# Altium schematic sheet dc-dc_eth.SchDoc
size 420 x 297 mm; Address1: Address1; Address2: Address2; Address3: Address3; Address4: Address4; SheetNumber: 4; SheetTotal: 5
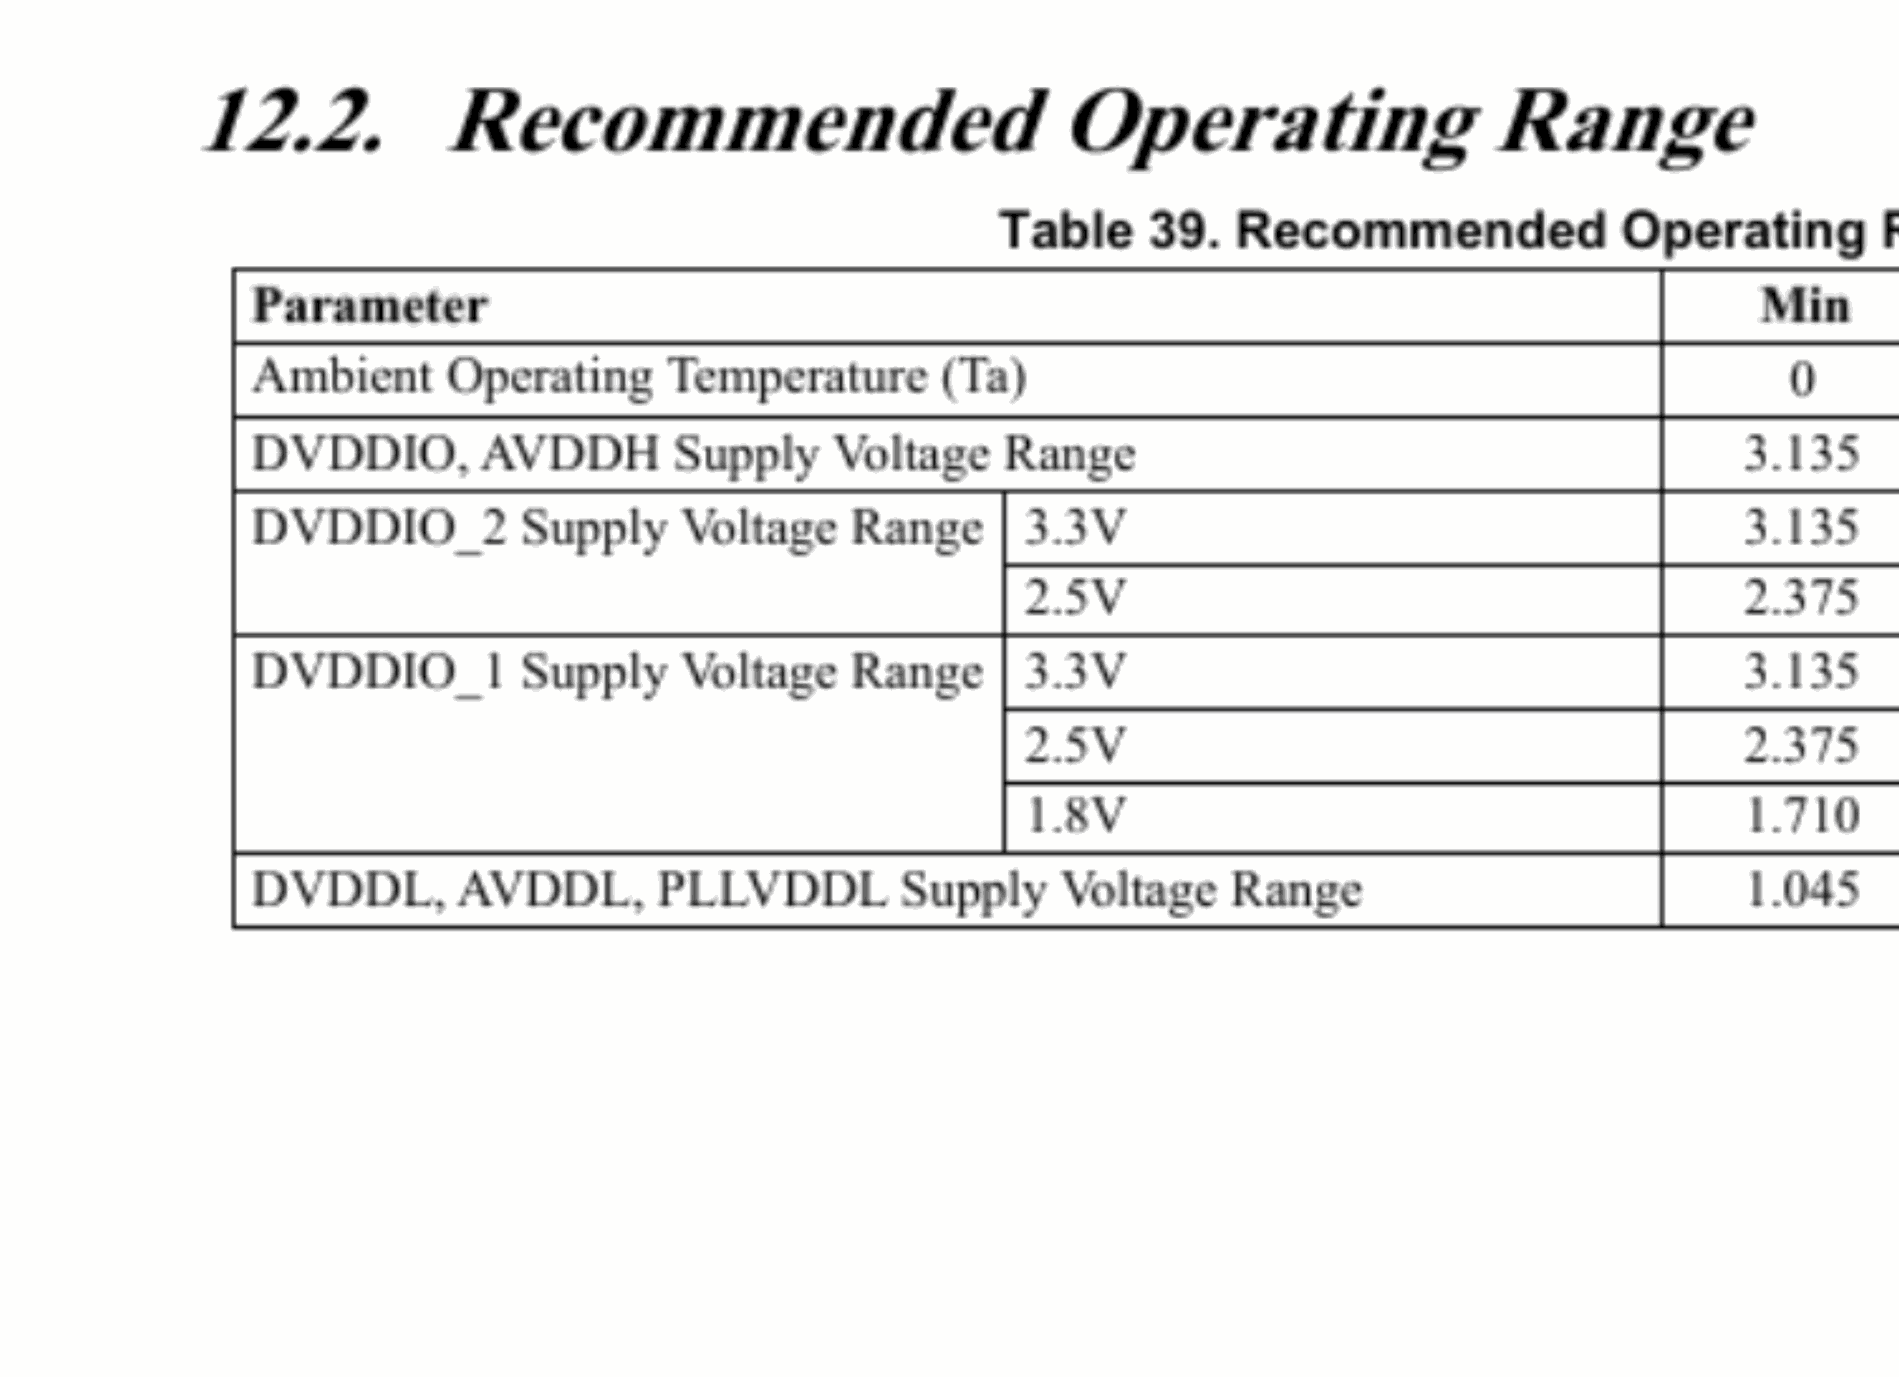
[diagram p0: dc-dc_eth.SchDoc, top left]
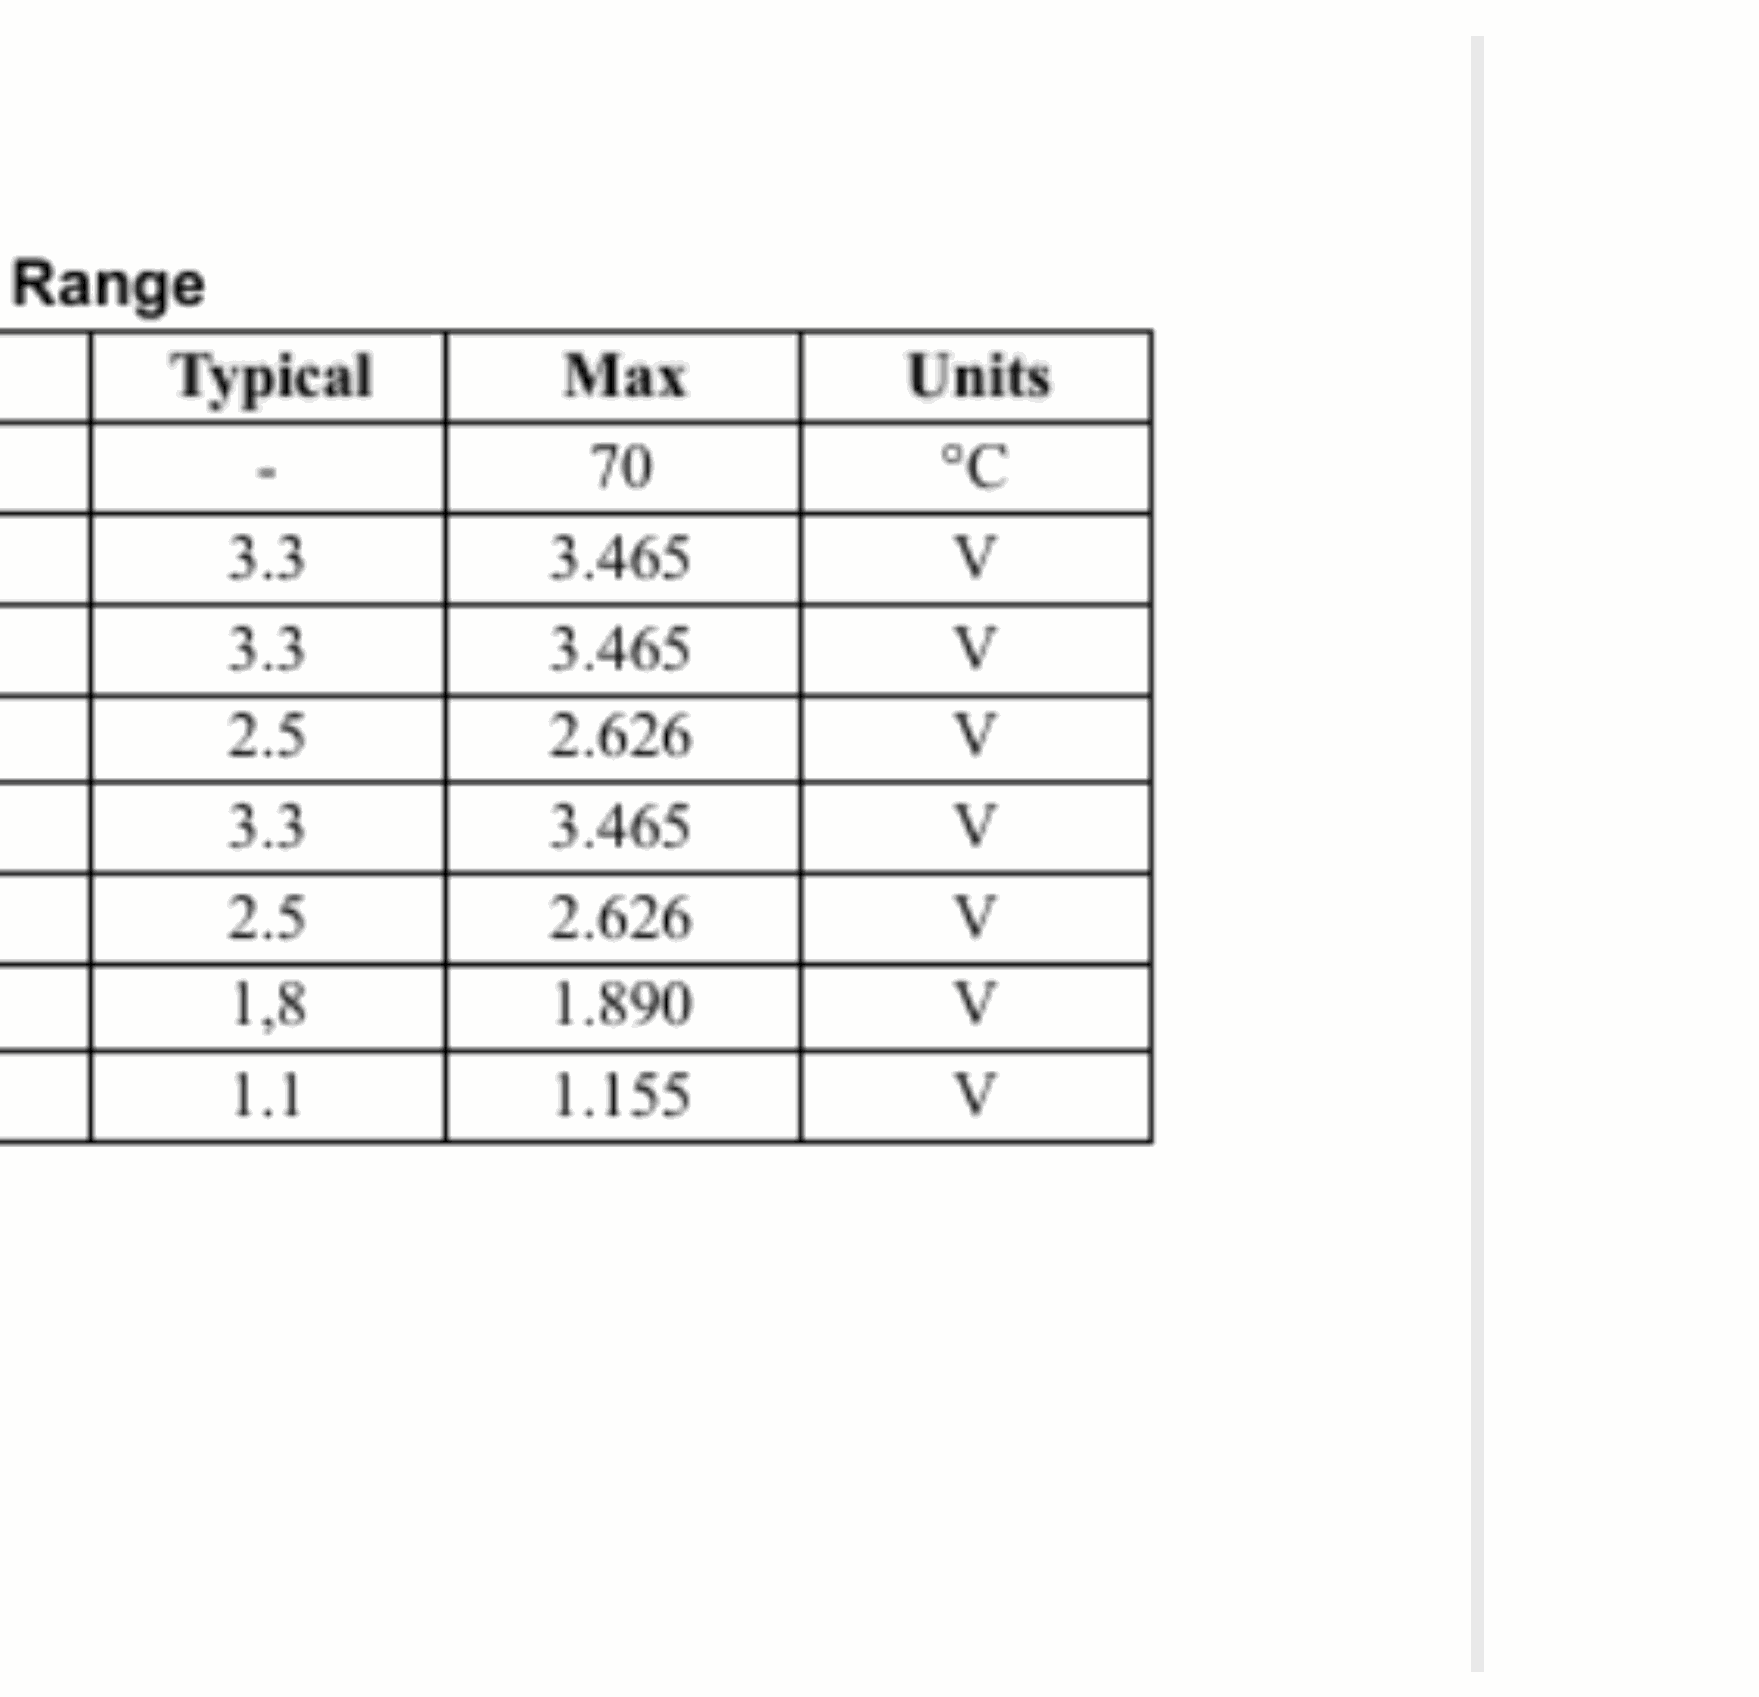
[diagram p1: dc-dc_eth.SchDoc, top right]
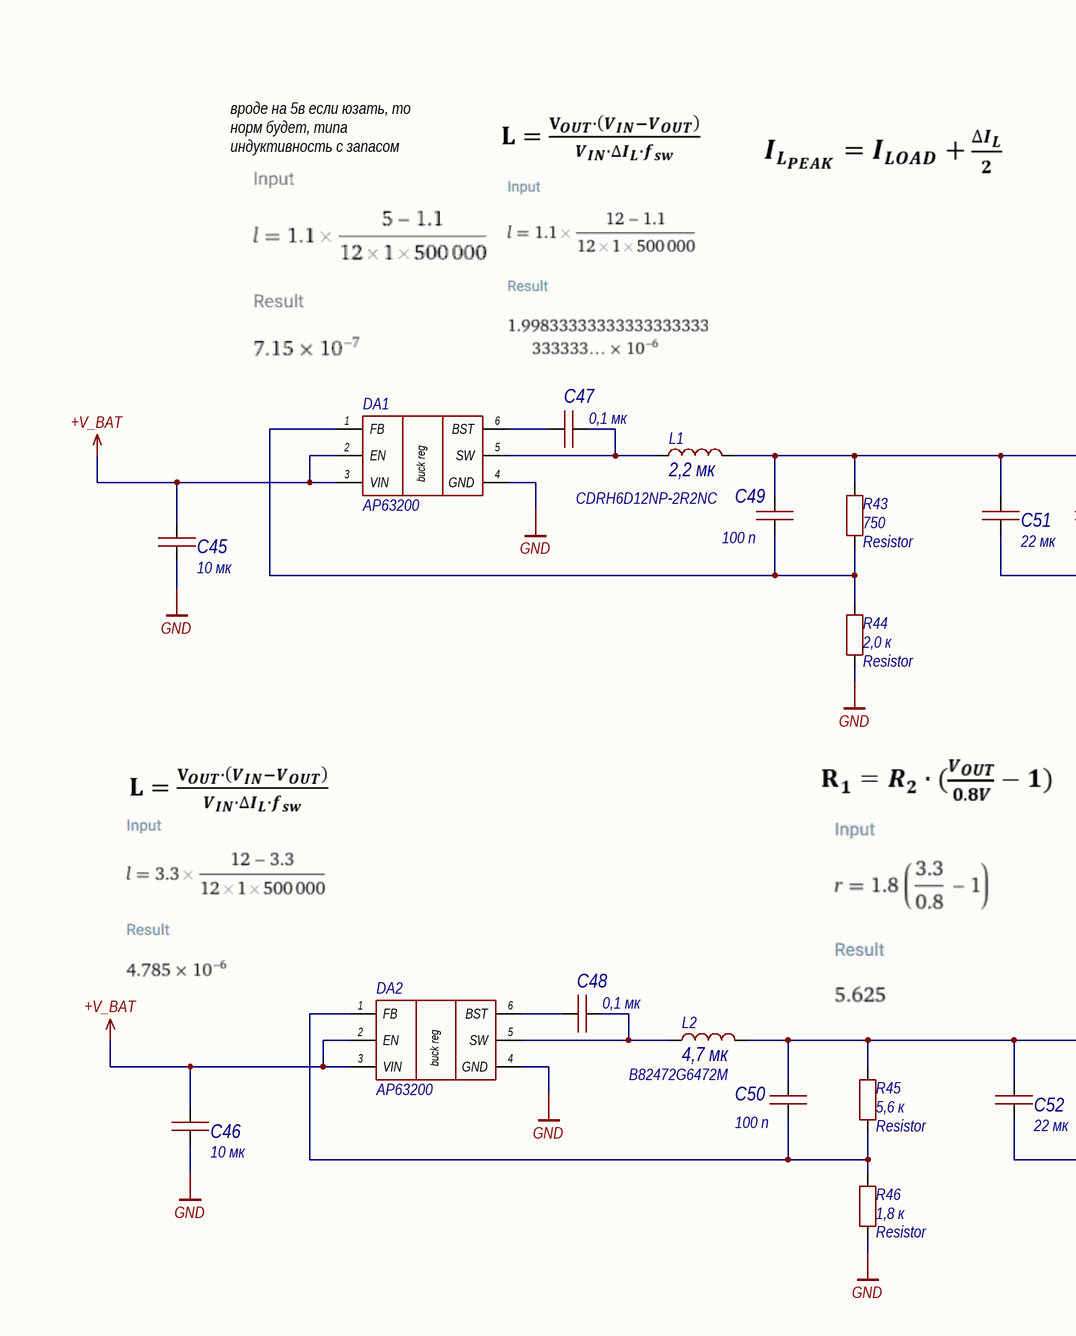
[diagram p2: dc-dc_eth.SchDoc, bottom left]
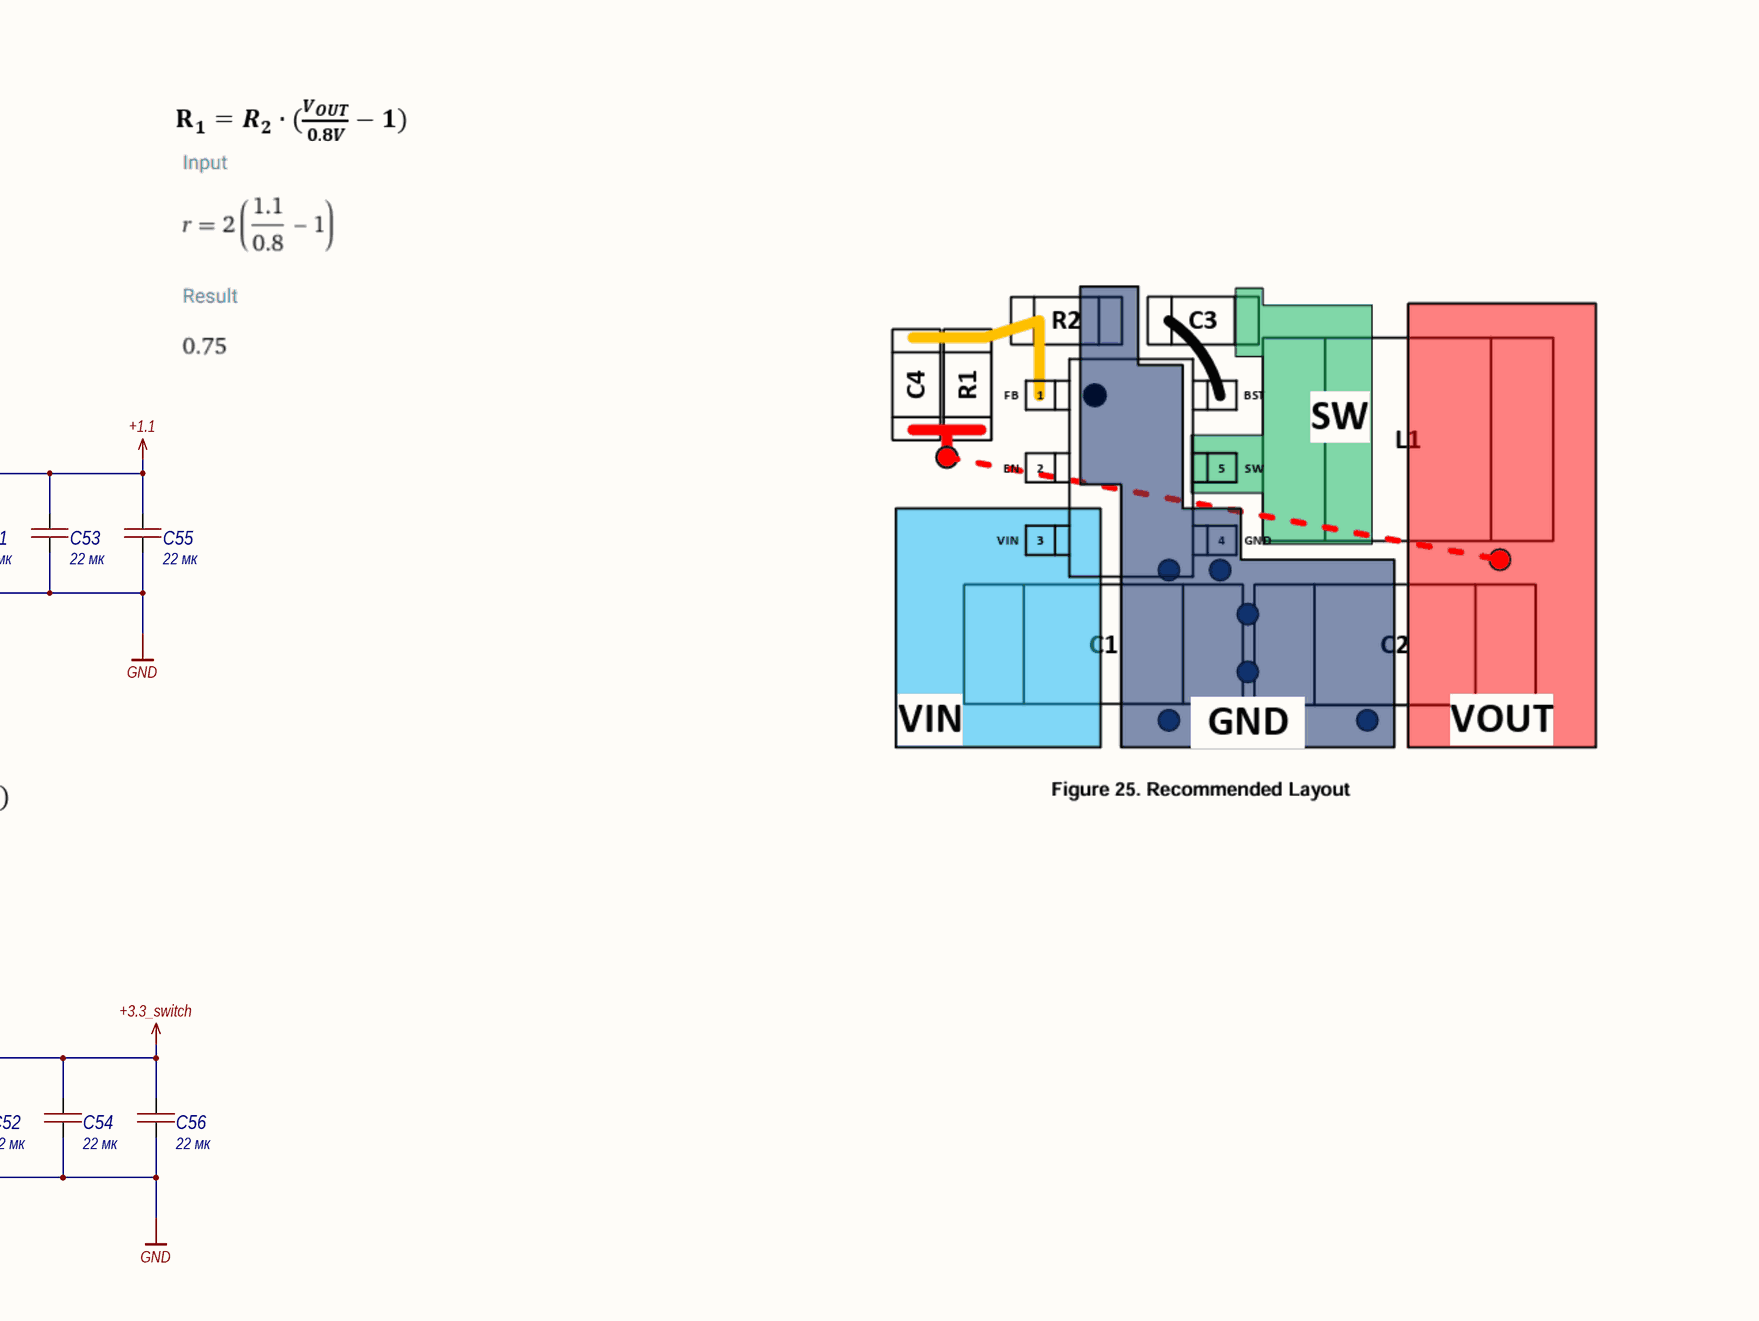
[diagram p3: dc-dc_eth.SchDoc, bottom right]

## Parts
C45  value 10 мк  [1210C]  (hidden comment: Capacitor)
C46  value 10 мк  [1210C]  (hidden comment: Capacitor)
C47  value 0,1 мк  [0603C]  (hidden comment: Capacitor)
C48  value 0,1 мк  [0603C]  (hidden comment: Capacitor)
C49  value 100 п  [0603C]  (hidden comment: Capacitor)
C50  value 100 п  [0603C]  (hidden comment: Capacitor)
C51  value 22 мк  [1210C]  (hidden comment: Capacitor)
C52  value 22 мк  [1210C]  (hidden comment: Capacitor)
C53  value 22 мк  [1210C]  (hidden comment: Capacitor)
C54  value 22 мк  [1210C]  (hidden comment: Capacitor)
C55  value 22 мк  [1210C]  (hidden comment: Capacitor)
C56  value 22 мк  [1210C]  (hidden comment: Capacitor)
DA1  AP63200  [TSOT26]
DA2  AP63200  [TSOT26]
L1  CDRH6D12NP-2R2NC  value 2,2 мк  [CDRH6D12]
L2  B82472G6472M  value 4,7 мк  [B82462G4]
R43  Resistor  value 750  [0603R]
R44  Resistor  value 2,0 к  [0603R]
R45  Resistor  value 5,6 к  [0603R]
R46  Resistor  value 1,8 к  [0603R]

## Nets
+1.1: C49.2 C51.2 C53.2 C55.2 L1.3 R43.2
+3.3_switch: C50.2 C52.2 C54.2 C56.2 L2.2 R45.2
+V_BAT: C45.2 C46.2 DA1.2(EN) DA1.3(VIN) DA2.2(EN) DA2.3(VIN)
GND: C45.1 C46.1 C51.1 C52.1 C53.1 C54.1 C55.1 C56.1 DA1.4(GND) DA2.4(GND) R44.1 R46.1
NetC47_1: C47.1 DA1.6(BST)
NetC47_2: C47.2 DA1.5(SW) L1.1
NetC48_1: C48.1 DA2.6(BST)
NetC48_2: C48.2 DA2.5(SW) L2.1
NetC49_1: C49.1 DA1.1(FB) R43.1 R44.2
NetC50_1: C50.1 DA2.1(FB) R45.1 R46.2

## Notes on the sheet
- вроде на 5в если юзать, то норм будет, типа индуктивность с запасом
- Перв. примен.
- Справ. №
- Подп. и дата
- Инв. № дубл.
- Взам. инв. №
- Разраб.
- Изм.
- Лист
- № докум.
- Подп.
- Дата
- Лит.
- Масса
- Масштаб
- Пров.
- Т.контр.
- Схема электрическая принципиальная
- Листов
- Инв. № подл.
- Утв.
- Н.контр.
- Копировал
- Формат А3
- (in symbol AP63200) buck reg

## Library data of the parts
C45 C46 = Capacitor_10u_10_35V_X7R_1210C: Конденсатор; Library Path2: Schematic\Capacitor.SchLib; Tolerance: 0,1; Voltage (V): 35; Dielectric: X7R; Capacity (nF): 10000; Part Number: Capacitor_10u_10_35V_X7R_1210C
C47 C48 = Capacitor_0,1u_10_50V_X7R_0603C: Конденсатор; Library Path2: Schematic\Capacitor.SchLib; Tolerance: 0,1; Voltage (V): 50; Dielectric: X7R; Capacity (nF): 100; Part Number: Capacitor_0,1u_10_50V_X7R_0603C
C49 C50 = Capacitor_100p_10_50V_X7R_0603C: Конденсатор; Library Path2: Schematic\Capacitor.SchLib; Tolerance: 0,1; Voltage (V): 50; Dielectric: X7R; Part Number: Capacitor_100p_10_50V_X7R_0603C; Capacity (nF): 0,1
C51-C56 = Capacitor_22u_10_25V_X7R_1210C: Конденсатор; Library Path2: Schematic\Capacitor.SchLib; Tolerance: 0,1; Voltage (V): 25; Dielectric: X7R; Capacity (nF): 22000; Part Number: Capacitor_22u_10_25V_X7R_1210C
DA1 DA2 = AP63200: DC-DC понижающий преобразователь, Vin: 3.8 - 40 В, adj, 2 А; Part Number: AP63200
L1 = CDRH6D12NP-2R2NC: Индуктивность на 2,2 мкГн, номинальный ток 2,5 А; Inductance (μH): 2,2; Current (A): 2,5; Part Number: CDRH6D12NP-2R2NC
L2 = B82472G6472M: Индуктивность на 4,7 мкГн, номинальный ток 2,5 А; Inductance (μH): 4,7; Current (A): 2,5; Part Number: B82472G6472M
R43 = Resistor_750_1_0603: Резистор номиналом 750 Ом 1%; Power: *; Part Number: Resistor_750_1_0603; Tolerance: 1%
R44 = Resistor_2.0k_1_0603: Резистор номиналом 2,0 кОм 1%; Power: *; Part Number: Resistor_2.0k_1_0603; Tolerance: 1%
R45 = Resistor_5.6k_1_0603: Резистор номиналом 5,6 кОм 1%; Power: *; Part Number: Resistor_5.6k_1_0603; Tolerance: 1%
R46 = Resistor_1.8k_1_0603: Резистор номиналом 1,8 кОм 1%; Power: *; Part Number: Resistor_1.8k_1_0603; Tolerance: 1%